# EAGLE schematic slave_board (EAGLE 9.2.2)

## Sheet 1 of 6: Main
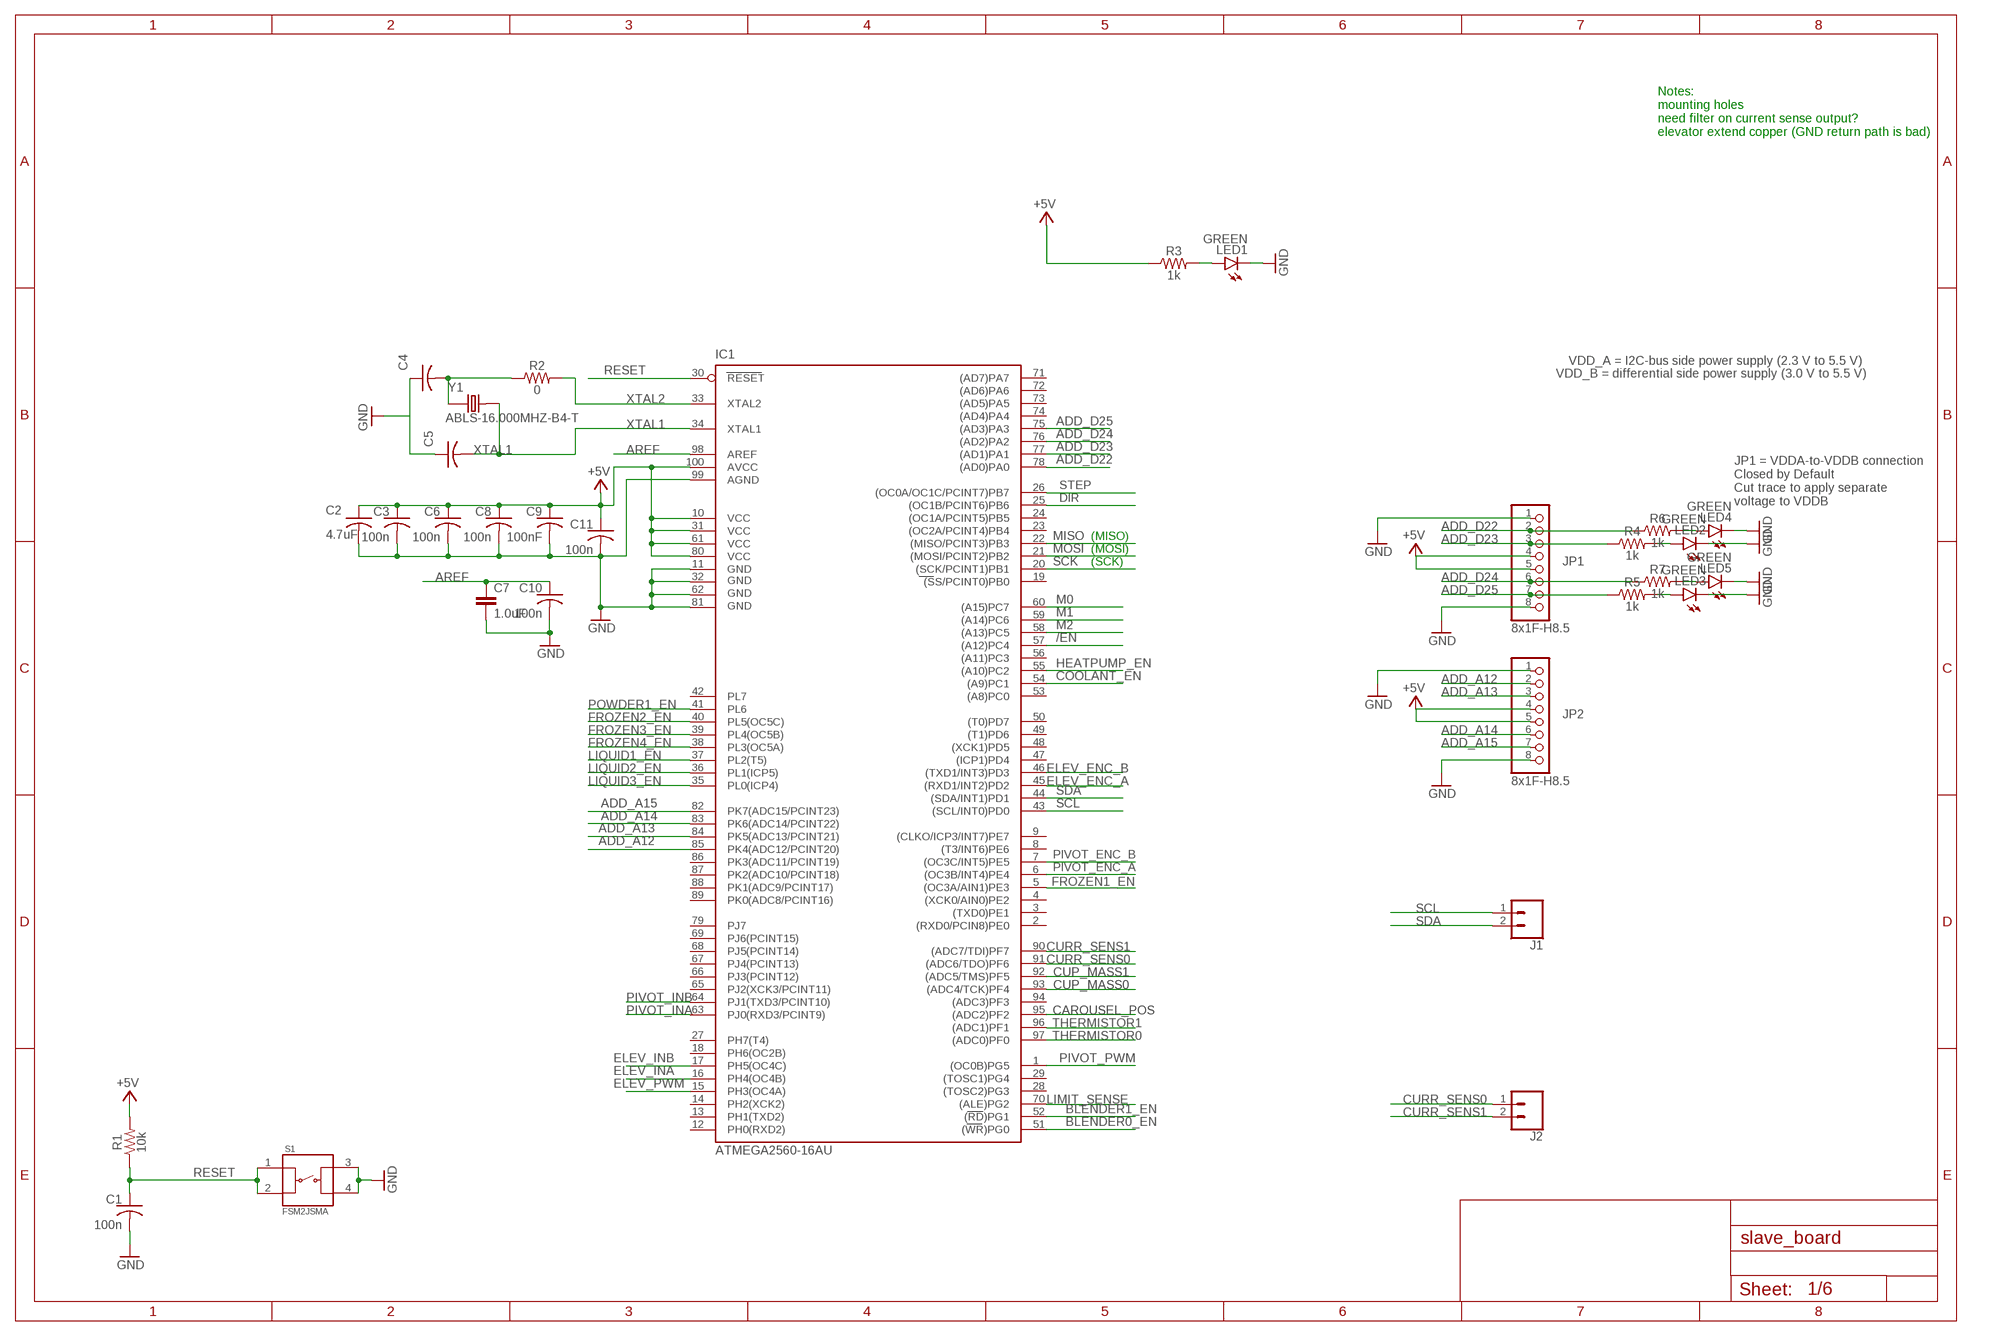
[diagram p0: schematic, sheet 1]

### Parts
C1  100n  C-USC0603  [C0603]
C2  4.7uF  C-USC0603  [C0603]
C3  100n  C-USC0603  [C0603]
C4  15pF  C-USC0603  [C0603]
C5  15pF  C-USC0603  [C0603]
C6  100n  C-USC0603  [C0603]
C7  1.0uF  1.0UF-0603-16V-10%  [0603]
C8  100n  C-USC0603  [C0603]
C9  100nF  C-USC0603  [C0603]
C10  100n  C-USC0603  [C0603]
C11  100n  C-USC0603  [C0603]
IC1  ATMEGA2560-16AU  ATMEGA25602560-16AU  [TQFP100]
J1  CONN_02  [1X02]
J2  CONN_02  [1X02]
JP1  8x1F-H8.5  PINHD-1X8  [1X08]
JP2  8x1F-H8.5  PINHD-1X8  [1X08]
LED1  GREEN  LEDCHIP-LED0805  [CHIP-LED0805]
LED2  GREEN  LEDCHIP-LED0805  [CHIP-LED0805]
LED3  GREEN  LEDCHIP-LED0805  [CHIP-LED0805]
LED4  GREEN  LEDCHIP-LED0805  [CHIP-LED0805]
LED5  GREEN  LEDCHIP-LED0805  [CHIP-LED0805]
R1  10k  10KOHM-0603-1/10W-1%  [0603]
R2  0  0OHM-0603-1/10W-5%  [0603]
R3  1k  1KOHM-0603-1/10W-1%  [0603]
R4  1k  1KOHM-0603-1/10W-1%  [0603]
R5  1k  1KOHM-0603-1/10W-1%  [0603]
R6  1k  1KOHM-0603-1/10W-1%  [0603]
R7  1k  1KOHM-0603-1/10W-1%  [0603]
S1  FSM2JSMA  [FSM2JSMA]
Y1  ABLS-16.000MHZ-B4-T  [ABLS-16.000MHZ-B4-T]

### Nets
+5V: C2.1 C3.1 C6.1 C8.1 C9.1 C11.1 IC1.10(VCC) IC1.31(VCC1) IC1.61(VCC2) IC1.80(VCC3) IC1.100(AVCC) JP1.4 JP1.5 JP2.4 JP2.5 R1.2 R3.1 ; also sheet 2,3,5,6
/EN: IC1.57((A12)PC4) ; also sheet 3
ADD_A12: IC1.85(PK4(ADC12/PCINT20)) JP2.2
ADD_A13: IC1.84(PK5(ADC13/PCINT21)) JP2.3
ADD_A14: IC1.83(PK6(ADC14/PCINT22)) JP2.6
ADD_A15: IC1.82(PK7(ADC15/PCINT23)) JP2.7
ADD_D22: IC1.78((AD0)PA0) JP1.2 R6.1
ADD_D23: IC1.77((AD1)PA1) JP1.3 R4.1
ADD_D24: IC1.76((AD2)PA2) JP1.6 R7.1
ADD_D25: IC1.75((AD3)PA3) JP1.7 R5.1
AREF: C7.1 C10.1 IC1.98(AREF)
BLENDER0_EN: IC1.51((WR)PG0) ; also sheet 3
BLENDER1_EN: IC1.52((RD)PG1) ; also sheet 3
CAROUSEL_POS: IC1.95((ADC2)PF2) ; also sheet 5
COOLANT_EN: IC1.54((A9)PC1) ; also sheet 3
CUP_MASS0: IC1.93((ADC4/TCK)PF4) ; also sheet 5
CUP_MASS1: IC1.92((ADC5/TMS)PF5) ; also sheet 5
CURR_SENS0: IC1.91((ADC6/TDO)PF6) J2.1 ; also sheet 4
CURR_SENS1: IC1.90((ADC7/TDI)PF7) J2.2 ; also sheet 4
DIR [gnd]: IC1.25((OC1B/PCINT6)PB6) ; also sheet 3
ELEV_ENC_A: IC1.45((RXD1/INT2)PD2) ; also sheet 5
ELEV_ENC_B: IC1.46((TXD1/INT3)PD3) ; also sheet 5
ELEV_INA: IC1.16(PH4(OC4B)) ; also sheet 4
ELEV_INB: IC1.17(PH5(OC4C)) ; also sheet 4
ELEV_PWM: IC1.15(PH3(OC4A)) ; also sheet 4
FROZEN1_EN: IC1.5((OC3A/AIN1)PE3) ; also sheet 3
FROZEN2_EN: IC1.40(PL5(OC5C)) ; also sheet 3
FROZEN3_EN: IC1.39(PL4(OC5B)) ; also sheet 3
FROZEN4_EN: IC1.38(PL3(OC5A)) ; also sheet 3
GND: C1.2 C2.2 C3.2 C4.1 C5.1 C6.2 C7.2 C8.2 C9.2 C10.2 C11.2 IC1.11(GND) IC1.32(GND1) IC1.62(GND2) IC1.81(GND3) IC1.99(AGND) JP1.1 JP1.8 JP2.1 JP2.8 LED1.C LED2.C LED3.C LED4.C LED5.C S1.3 S1.4 ; also sheet 2,3,4,5,6
HEATPUMP_EN: IC1.55((A10)PC2) ; also sheet 3
LIMIT_SENSE: IC1.70((ALE)PG2) ; also sheet 5
LIQUID1_EN: IC1.37(PL2(T5)) ; also sheet 3
LIQUID2_EN: IC1.36(PL1(ICP5)) ; also sheet 3
LIQUID3_EN: IC1.35(PL0(ICP4)) ; also sheet 3
M0: IC1.60((A15)PC7) ; also sheet 3
M1: IC1.59((A14)PC6) ; also sheet 3
M2: IC1.58((A13)PC5) ; also sheet 3
MISO: IC1.22((MISO/PCINT3)PB3) ; also sheet 2
MOSI: IC1.21((MOSI/PCINT2)PB2) ; also sheet 2
N$2: LED5.A R7.2
N$3: LED1.A R3.2
N$5: LED3.A R5.2
N$9: LED4.A R6.2
N$10: LED2.A R4.2
N$13: C4.2 R2.1 Y1.1
PIVOT_ENC_A: IC1.6((OC3B/INT4)PE4) ; also sheet 5
PIVOT_ENC_B: IC1.7((OC3C/INT5)PE5) ; also sheet 5
PIVOT_INA: IC1.63(PJ0(RXD3/PCINT9)) ; also sheet 4
PIVOT_INB: IC1.64(PJ1(TXD3/PCINT10)) ; also sheet 4
PIVOT_PWM: IC1.1((OC0B)PG5) ; also sheet 4
POWDER1_EN: IC1.41(PL6) ; also sheet 3
RESET: C1.1 IC1.30(RESET) R1.1 S1.1 S1.2 ; also sheet 2
SCK: IC1.20((SCK/PCINT1)PB1) ; also sheet 2
SCL: IC1.43((SCL/INT0)PD0) J1.1 ; also sheet 2
SDA: IC1.44((SDA/INT1)PD1) J1.2 ; also sheet 2
STEP: IC1.26((OC0A/OC1C/PCINT7)PB7) ; also sheet 3
THERMISTOR0 [gnd]: IC1.97((ADC0)PF0) ; also sheet 5
THERMISTOR1: IC1.96((ADC1)PF1) ; also sheet 5
XTAL1: C5.2 IC1.34(XTAL1) Y1.2
XTAL2: IC1.33(XTAL2) R2.2
Unconnected: IC1.2((RXD0/PCIN8)PE0) IC1.3((TXD0)PE1) IC1.4((XCK0/AIN0)PE2) IC1.8((T3/INT6)PE6) IC1.9((CLKO/ICP3/INT7)PE7) IC1.12(PH0(RXD2)) IC1.13(PH1(TXD2)) IC1.14(PH2(XCK2)) IC1.18(PH6(OC2B)) IC1.19((SS/PCINT0)PB0) IC1.23((OC2A/PCINT4)PB4) IC1.24((OC1A/PCINT5)PB5) IC1.27(PH7(T4)) IC1.28((TOSC2)PG3) IC1.29((TOSC1)PG4) IC1.42(PL7) IC1.47((ICP1)PD4) IC1.48((XCK1)PD5) IC1.49((T1)PD6) IC1.50((T0)PD7) IC1.53((A8)PC0) IC1.56((A11)PC3) IC1.65(PJ2(XCK3/PCINT11)) IC1.66(PJ3(PCINT12)) IC1.67(PJ4(PCINT13)) IC1.68(PJ5(PCINT14)) IC1.69(PJ6(PCINT15)) IC1.71((AD7)PA7) IC1.72((AD6)PA6) IC1.73((AD5)PA5) IC1.74((AD4)PA4) IC1.79(PJ7) IC1.86(PK3(ADC11/PCINT19)) IC1.87(PK2(ADC10/PCINT18)) IC1.88(PK1(ADC9/PCINT17)) IC1.89(PK0(ADC8/PCINT16)) IC1.94((ADC3)PF3)

### Notes on the sheet
- Notes:
  mounting holes
  need filter on current sense output?
  elevator extend copper (GND return path is bad)
- VDD_A = I2C-bus side power supply (2.3 V to 5.5 V)
- VDD_B = differential side power supply (3.0 V to 5.5 V)
- JP1 = VDDA-to-VDDB connection
  Closed by Default
  Cut trace to apply separate 
  voltage to VDDB
- (MISO)
- (MOSI)
- (SCK)

## Sheet 2 of 6: COMMS
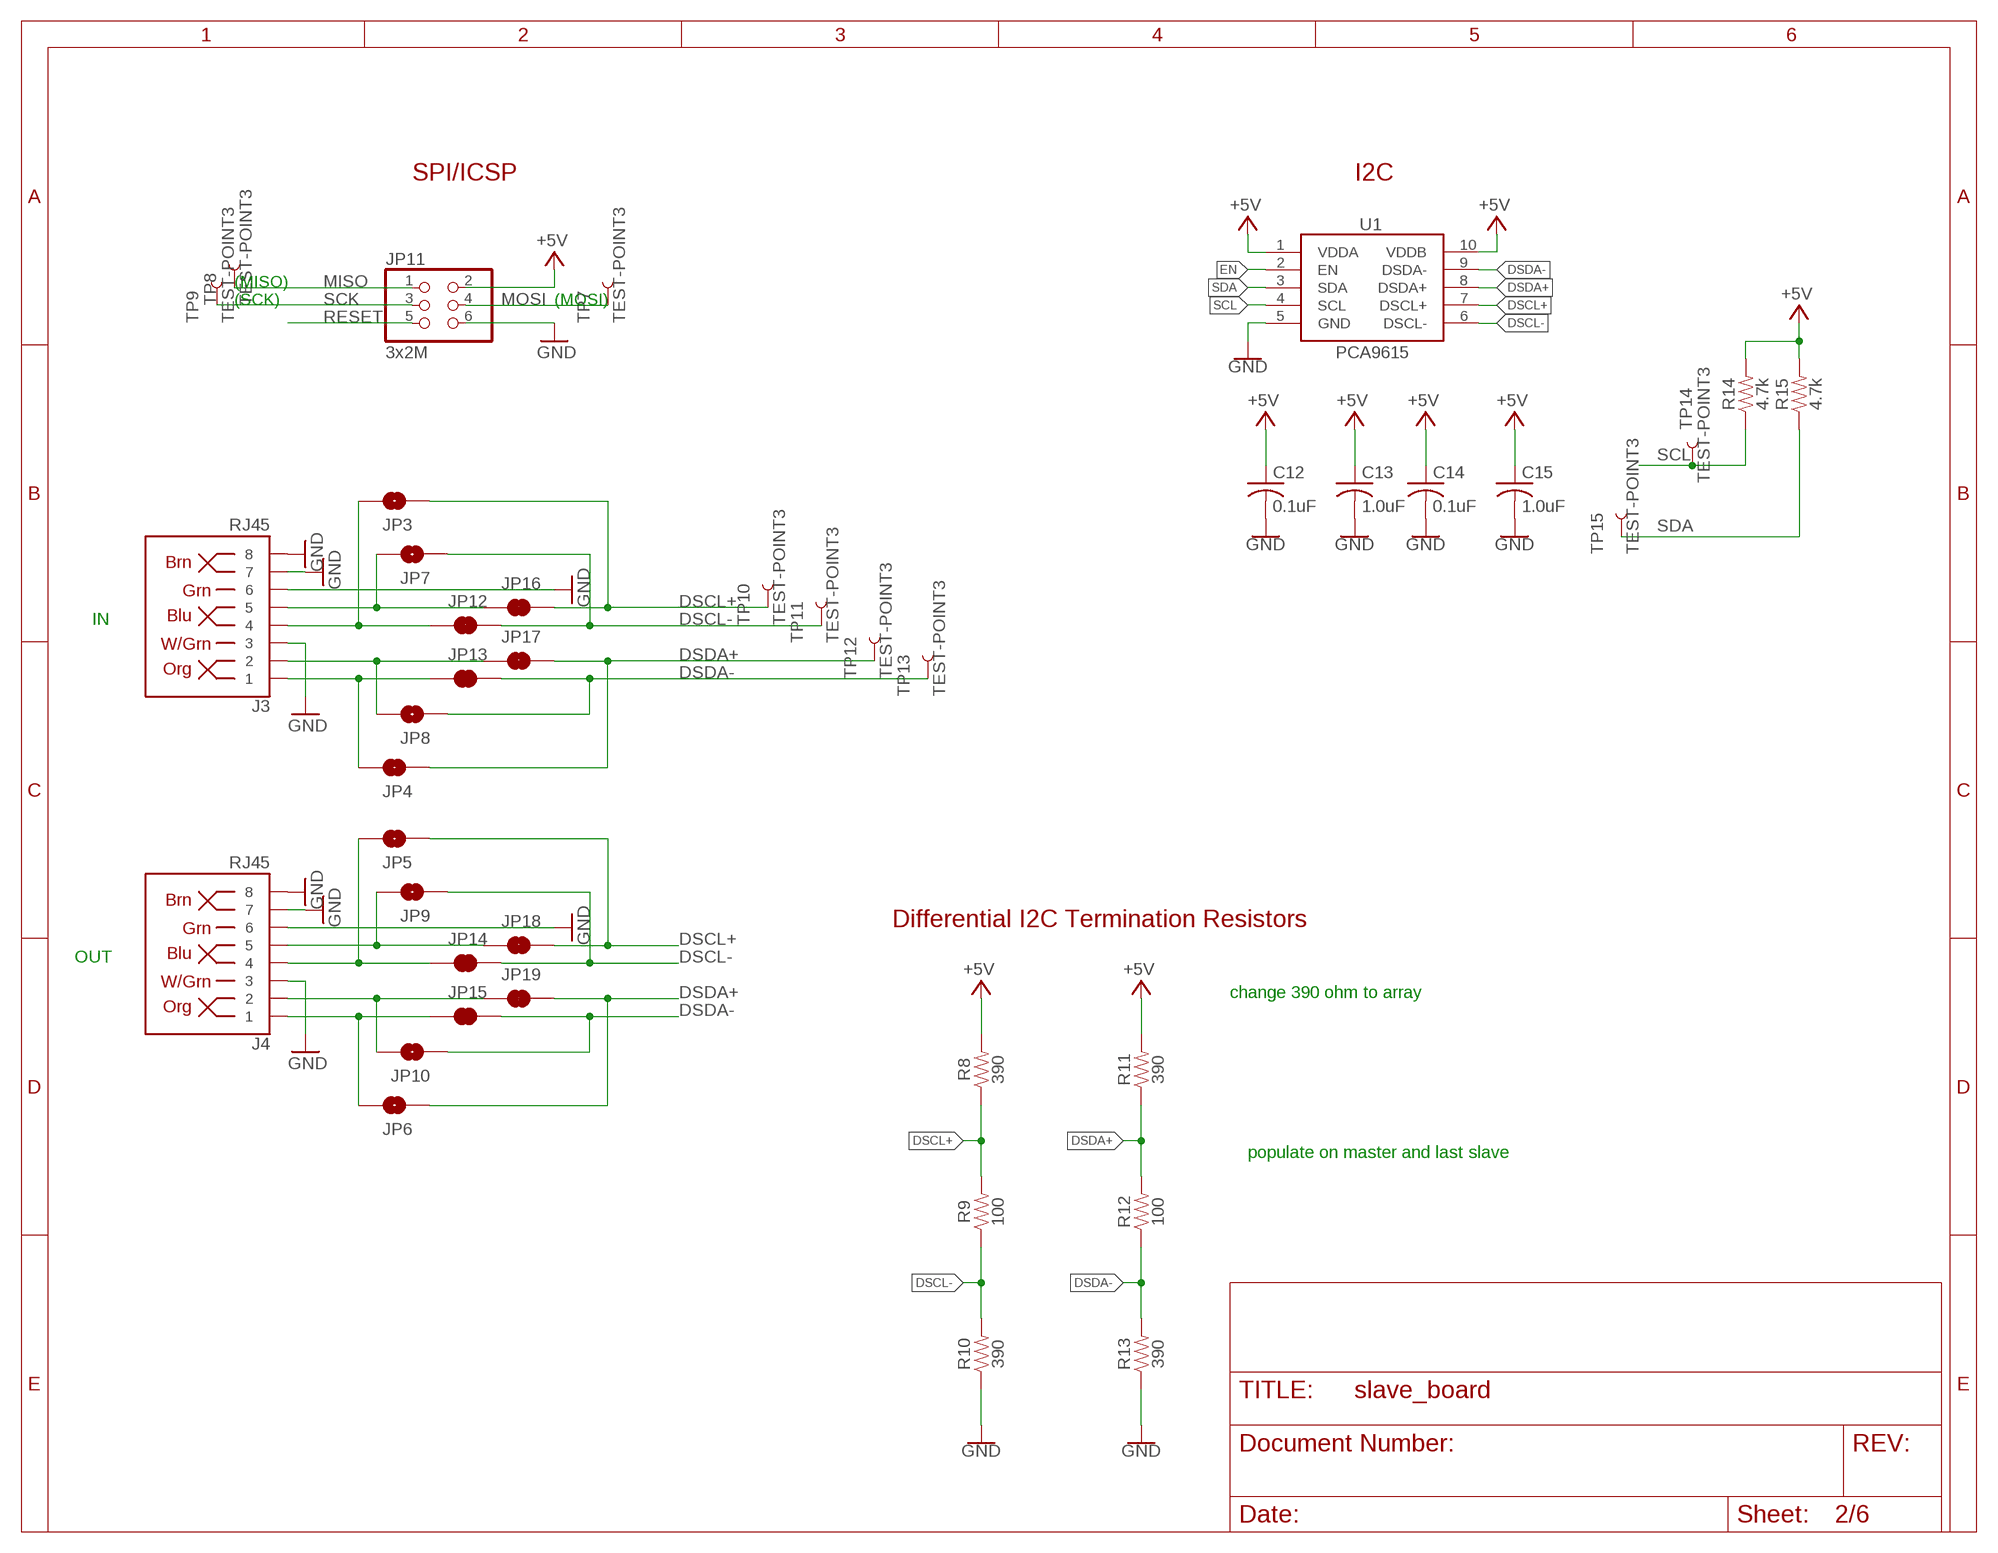
[diagram p1: schematic, sheet 2]

### Parts
C12  0.1uF  C-USC0603  [C0603]
C13  1.0uF  C-USC0603  [C0603]
C14  0.1uF  C-USC0603  [C0603]
C15  1.0uF  C-USC0603  [C0603]
J3  RJ45  RJ45-8  [RJ45-8]
J4  RJ45  RJ45-8  [RJ45-8]
JP3  JUMPER-SMT_2_NO_NO-SILK  [SMT-JUMPER_2_NO_NO-SILK]
JP4  JUMPER-SMT_2_NO_NO-SILK  [SMT-JUMPER_2_NO_NO-SILK]
JP5  JUMPER-SMT_2_NO_NO-SILK  [SMT-JUMPER_2_NO_NO-SILK]
JP6  JUMPER-SMT_2_NO_NO-SILK  [SMT-JUMPER_2_NO_NO-SILK]
JP7  JUMPER-SMT_2_NO_NO-SILK  [SMT-JUMPER_2_NO_NO-SILK]
JP8  JUMPER-SMT_2_NO_NO-SILK  [SMT-JUMPER_2_NO_NO-SILK]
JP9  JUMPER-SMT_2_NO_NO-SILK  [SMT-JUMPER_2_NO_NO-SILK]
JP10  JUMPER-SMT_2_NO_NO-SILK  [SMT-JUMPER_2_NO_NO-SILK]
JP11  3x2M  PINHD-2X3  [2X03]
JP12  JUMPER-SMT_2_NC_TRACE_NO-SILK  [SMT-JUMPER_2_NC_TRACE_NO-SILK]
JP13  JUMPER-SMT_2_NC_TRACE_NO-SILK  [SMT-JUMPER_2_NC_TRACE_NO-SILK]
JP14  JUMPER-SMT_2_NC_TRACE_NO-SILK  [SMT-JUMPER_2_NC_TRACE_NO-SILK]
JP15  JUMPER-SMT_2_NC_TRACE_NO-SILK  [SMT-JUMPER_2_NC_TRACE_NO-SILK]
JP16  JUMPER-SMT_2_NC_TRACE_NO-SILK  [SMT-JUMPER_2_NC_TRACE_NO-SILK]
JP17  JUMPER-SMT_2_NC_TRACE_NO-SILK  [SMT-JUMPER_2_NC_TRACE_NO-SILK]
JP18  JUMPER-SMT_2_NC_TRACE_NO-SILK  [SMT-JUMPER_2_NC_TRACE_NO-SILK]
JP19  JUMPER-SMT_2_NC_TRACE_NO-SILK  [SMT-JUMPER_2_NC_TRACE_NO-SILK]
R8  390  390OHM-0603-1/10W-1%  [0603]
R9  100  100OHM-0603-1/10W-1%  [0603]
R10  390  390OHM-0603-1/10W-1%  [0603]
R11  390  390OHM-0603-1/10W-1%  [0603]
R12  100  100OHM-0603-1/10W-1%  [0603]
R13  390  390OHM-0603-1/10W-1%  [0603]
R14  4.7k  4.7KOHM-0603-1/10W-1%  [0603]
R15  4.7k  4.7KOHM-0603-1/10W-1%  [0603]
TP7  TEST-POINT3  [PAD.03X.03]
TP8  TEST-POINT3  [PAD.03X.03]
TP9  TEST-POINT3  [PAD.03X.03]
TP10  TEST-POINT3  [PAD.03X.03]
TP11  TEST-POINT3  [PAD.03X.03]
TP12  TEST-POINT3  [PAD.03X.03]
TP13  TEST-POINT3  [PAD.03X.03]
TP14  TEST-POINT3  [PAD.03X.03]
TP15  TEST-POINT3  [PAD.03X.03]
U1  PCA9615  [SPARKFUN-IC-COMMS_TSSOP10]

### Nets
+5V: C12.1 C13.1 C14.1 C15.1 JP11.2 R8.2 R11.2 R14.2 R15.2 U1.1(VDDA) U1.10(VDDB) ; also sheet 1,3,5,6
DSCL+: J3.5 J4.5 JP3.1 JP5.1 JP7.2 JP9.2 JP16.1 JP16.2 JP18.1 JP18.2 R8.1 R9.2 TP10.P$1 U1.7(DSCL+)
DSCL-: J3.4 J4.4 JP3.2 JP5.2 JP7.1 JP9.1 JP12.1 JP12.2 JP14.1 JP14.2 R9.1 R10.2 TP11.P$1 U1.6(DSCL-)
DSDA+: J3.2 J4.2 JP4.1 JP6.1 JP8.2 JP10.2 JP17.1 JP17.2 JP19.1 JP19.2 R11.1 R12.2 TP12.P$1 U1.8(DSDA+)
DSDA-: J3.1 J4.1 JP4.2 JP6.2 JP8.1 JP10.1 JP13.1 JP13.2 JP15.1 JP15.2 R12.1 R13.2 TP13.P$1 U1.9(DSDA-)
EN: U1.2(EN)
GND: C12.2 C13.2 C14.2 C15.2 J3.3 J3.6 J3.7 J3.8 J4.3 J4.6 J4.7 J4.8 JP11.6 R10.1 R13.1 U1.5(GND) ; also sheet 1,3,4,5,6
MISO: JP11.1 TP8.P$1 ; also sheet 1
MOSI: JP11.4 TP7.P$1 ; also sheet 1
RESET: JP11.5 ; also sheet 1
SCK: JP11.3 TP9.P$1 ; also sheet 1
SCL: R14.1 TP14.P$1 U1.4(SCL) ; also sheet 1
SDA: R15.1 TP15.P$1 U1.3(SDA) ; also sheet 1

### Notes on the sheet
- SPI/ICSP | I2C
- (MISO)
- (SCK) | (MOSI)
- IN
- Differential I2C Termination Resistors
- OUT
- change 390 ohm to array
- populate on master and last slave

## Sheet 3 of 6: Motors1
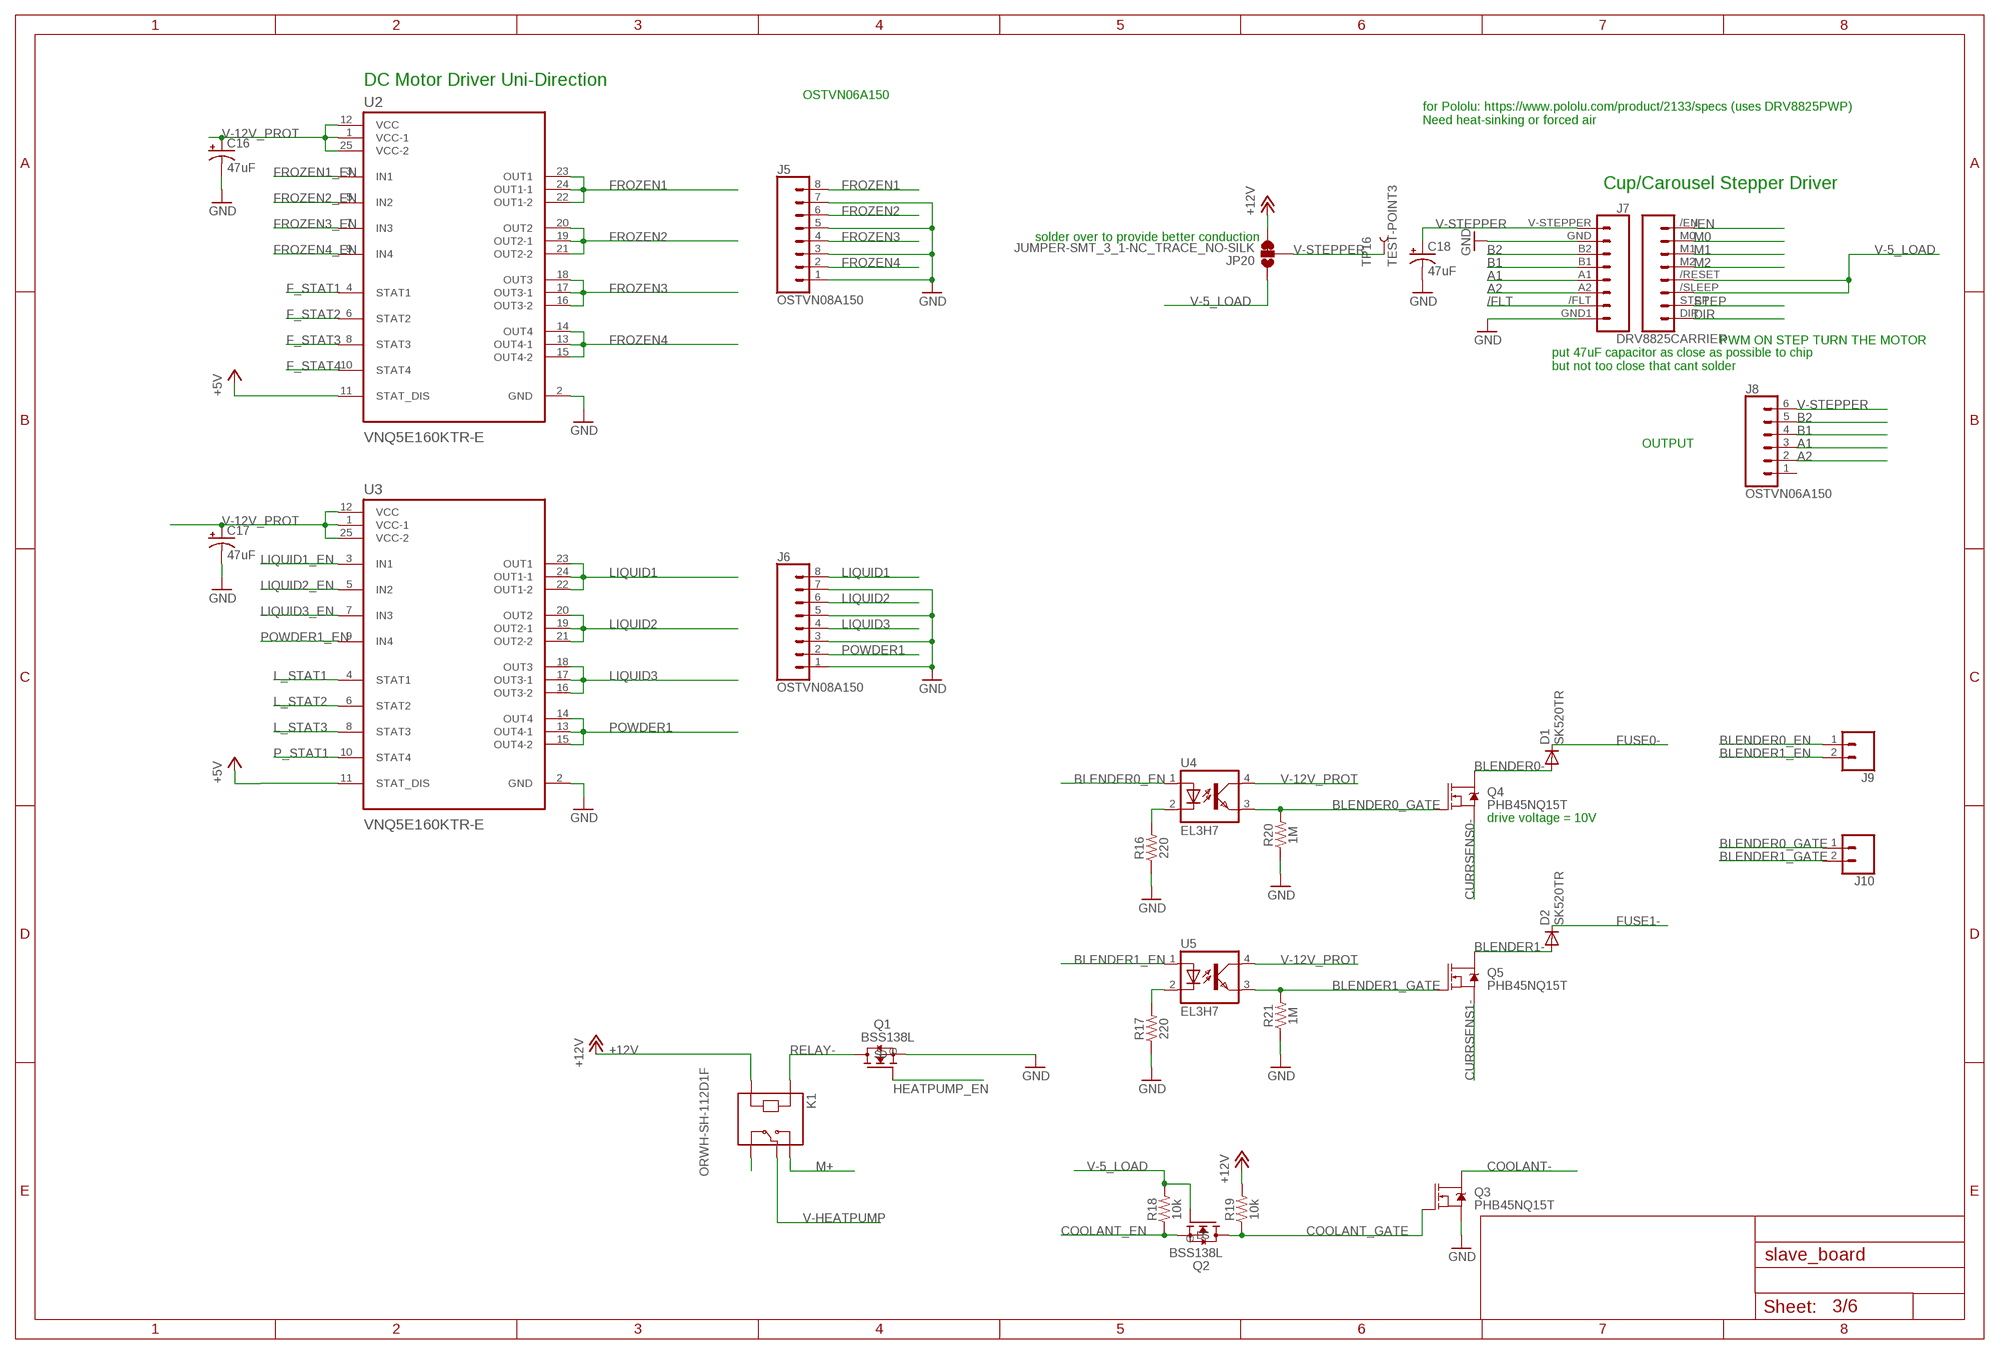
[diagram p2: schematic, sheet 3]

### Parts
C16  47uF  47UF-POLAR-PANASONIC_D-35V-20%  [PANASONIC_D]
C17  47uF  47UF-POLAR-PANASONIC_D-35V-20%  [PANASONIC_D]
C18  47uF  47UF-POLAR-PANASONIC_D-35V-20%  [PANASONIC_D]
D1  SK520TR  [SK520TR]
D2  SK520TR  [SK520TR]
J5  OSTVN08A150  [8PIN_SCREW_TERMINAL]
J6  OSTVN08A150  [8PIN_SCREW_TERMINAL]
J7  DRV8825CARRIER  [DRV8825CARRIER]
J8  OSTVN06A150  [6PIN_SCREW_TERMINAL]
J9  CONN_02  [1X02]
J10  CONN_02  [1X02]
JP20  JUMPER-SMT_3_1-NC_TRACE_NO-SILK  [SMT-JUMPER_3_1-NC_TRACE_NO-SILK]
K1  ORWH-SH-112D1F  [ORWH-SH-112D1F]
Q1  BSS138L  [BSS138L]
Q2  BSS138L  [BSS138L]
Q3  PHB45NQ15T  [PHB45NQ15T]
Q4  PHB45NQ15T  [PHB45NQ15T]
Q5  PHB45NQ15T  [PHB45NQ15T]
R16  220  220OHM-0603-1/10W-1%  [0603]
R17  220  220OHM-0603-1/10W-1%  [0603]
R18  10k  10KOHM-0603-1/10W-1%  [0603]
R19  10k  10KOHM-0603-1/10W-1%  [0603]
R20  1M  1MOHM-0603-1/4W-5%  [0603]
R21  1M  1MOHM-0603-1/4W-5%  [0603]
TP16  TEST-POINT3  [PAD.03X.03]
U2  VNQ5E160KTR-E  [SOP80P1030X245-25N]
U3  VNQ5E160KTR-E  [SOP80P1030X245-25N]
U4  EL3H7  [EL3H7]
U5  EL3H7  [EL3H7]

### Nets
+5V: U2.11(STAT_DIS) U3.11(STAT_DIS) ; also sheet 1,2,5,6
+12V [power]: JP20.3 K1.A2 R19.2 ; also sheet 4,6
/EN: J7./EN ; also sheet 1
/FLT: J7./FLT
A1: J7.A1 J8.3
A2: J7.A2 J8.2
B1: J7.B1 J8.4
B2: J7.B2 J8.5
BLENDER0-: D1.1(A) Q4.2(D) ; also sheet 4
BLENDER0_EN: J9.1 U4.1 ; also sheet 1
BLENDER0_GATE: J10.1 Q4.1(G) R20.2 U4.3
BLENDER1-: D2.1(A) Q5.2(D) ; also sheet 4
BLENDER1_EN: J9.2 U5.1 ; also sheet 1
BLENDER1_GATE: J10.2 Q5.1(G) R21.2 U5.3
COOLANT- [power]: Q3.2(D) ; also sheet 4
COOLANT_EN: Q2.S R18.1 ; also sheet 1
COOLANT_GATE: Q2.D Q3.1(G) R19.1
CURRSENS0-: Q4.3(S) ; also sheet 4
CURRSENS1-: Q5.3(S) ; also sheet 4
DIR [gnd]: J7.DIR ; also sheet 1
F_STAT1: U2.4(STAT1)
F_STAT2: U2.6(STAT2)
F_STAT3: U2.8(STAT3)
F_STAT4: U2.10(STAT4)
FROZEN1: J5.8 U2.22(OUT1-2) U2.23(OUT1) U2.24(OUT1-1)
FROZEN1_EN: U2.3(IN1) ; also sheet 1
FROZEN2: J5.6 U2.19(OUT2-1) U2.20(OUT2) U2.21(OUT2-2)
FROZEN2_EN: U2.5(IN2) ; also sheet 1
FROZEN3: J5.4 U2.16(OUT3-2) U2.17(OUT3-1) U2.18(OUT3)
FROZEN3_EN: U2.7(IN3) ; also sheet 1
FROZEN4: J5.2 U2.13(OUT4-1) U2.14(OUT4) U2.15(OUT4-2)
FROZEN4_EN: U2.9(IN4) ; also sheet 1
FUSE0- [HVDC]: D1.2(C) ; also sheet 4
FUSE1- [HVDC]: D2.2(C) ; also sheet 4
GND: C16.- C17.- C18.- J5.1 J5.3 J5.5 J5.7 J6.1 J6.3 J6.5 J6.7 J7.GND J7.GND1 Q1.S Q3.3(S) R16.1 R17.1 R20.1 R21.1 U2.2(GND) U3.2(GND) ; also sheet 1,2,4,5,6
HEATPUMP_EN: Q1.G ; also sheet 1
L_STAT1: U3.4(STAT1)
L_STAT2: U3.6(STAT2)
L_STAT3: U3.8(STAT3)
LIQUID1: J6.8 U3.22(OUT1-2) U3.23(OUT1) U3.24(OUT1-1)
LIQUID1_EN: U3.3(IN1) ; also sheet 1
LIQUID2: J6.6 U3.19(OUT2-1) U3.20(OUT2) U3.21(OUT2-2)
LIQUID2_EN: U3.5(IN2) ; also sheet 1
LIQUID3: J6.4 U3.16(OUT3-2) U3.17(OUT3-1) U3.18(OUT3)
LIQUID3_EN: U3.7(IN3) ; also sheet 1
M0: J7.M0 ; also sheet 1
M1: J7.M1 ; also sheet 1
M2: J7.M2 ; also sheet 1
M+ [mains]: K1.NO ; also sheet 6
N$6 [gnd]: K1.NC
N$7: R17.2 U5.2
N$14: R16.2 U4.2
P_STAT1: U3.10(STAT4)
POWDER1: J6.2 U3.13(OUT4-1) U3.14(OUT4) U3.15(OUT4-2)
POWDER1_EN: U3.9(IN4) ; also sheet 1
RELAY- [gnd]: K1.A1 Q1.D
STEP: J7.STEP ; also sheet 1
V-5_LOAD: J7./RESET J7./SLEEP JP20.1 Q2.G R18.2 ; also sheet 4,6
V-12V_PROT [power]: C16.+ C17.+ U2.1(VCC-1) U2.12(VCC) U2.25(VCC-2) U3.1(VCC-1) U3.12(VCC) U3.25(VCC-2) U4.4 U5.4 ; also sheet 4,6
V-HEATPUMP [mains]: K1.COM ; also sheet 4
V-STEPPER: C18.+ J7.V-STEPPER J8.6 JP20.2 TP16.P$1
Unconnected: J8.1

### Notes on the sheet
- DC Motor Driver Uni-Direction
- OSTVN06A150
- for Pololu: https://www.pololu.com/product/2133/specs (uses DRV8825PWP)
  Need heat-sinking or forced air
- Cup/Carousel Stepper Driver
- solder over to provide better conduction
- PWM ON STEP TURN THE MOTOR
- put 47uF capacitor as close as possible to chip
  but not too close that cant solder
- OUTPUT
- drive voltage = 10V

## Sheet 4 of 6: Motors2
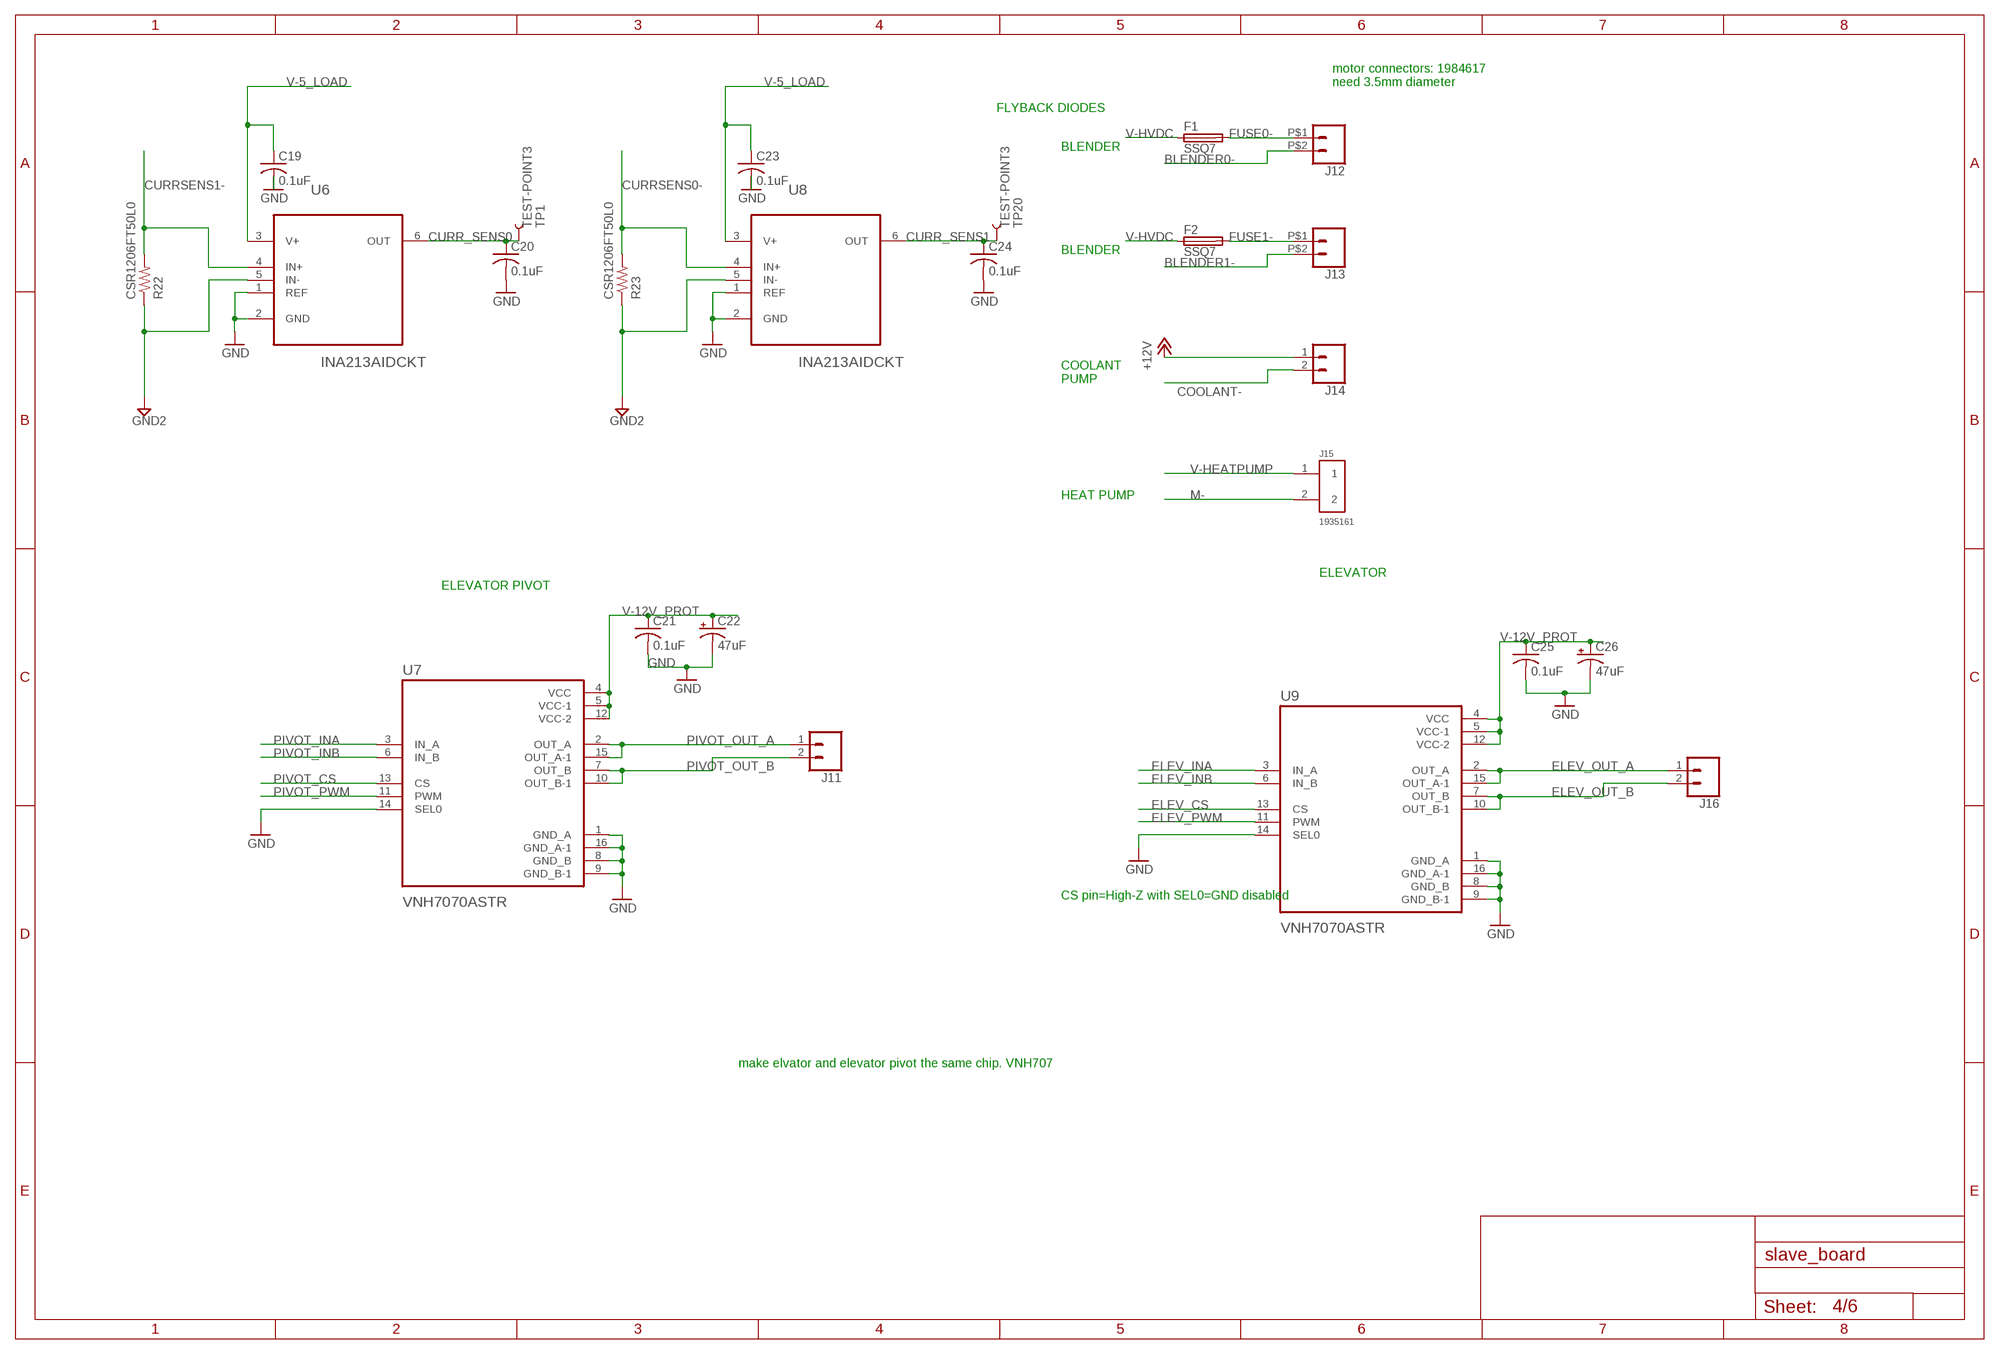
[diagram p3: schematic, sheet 4]

### Parts
C19  0.1uF  C-USC0603  [C0603]
C20  0.1uF  C-USC0603  [C0603]
C21  0.1uF  C-USC0603  [C0603]
C22  47uF  47UF-POLAR-PANASONIC_D-35V-20%  [PANASONIC_D]
C23  0.1uF  C-USC0603  [C0603]
C24  0.1uF  C-USC0603  [C0603]
C25  0.1uF  C-USC0603  [C0603]
C26  47uF  47UF-POLAR-PANASONIC_D-35V-20%  [PANASONIC_D]
F1  SSQ7  [SSQ7]
F2  SSQ7  [SSQ7]
J11  CONN_02  [1X02]
J12  CONN_02PTH2  [1X02_BIG]
J13  CONN_02PTH2  [1X02_BIG]
J14  CONN_02  [1X02]
J15  1935161  [PHOENIX_1935161]
J16  CONN_02  [1X02]
R22  CSR1206FT50L0  [CSR1206FT50L0]
R23  CSR1206FT50L0  [CSR1206FT50L0]
TP1  TEST-POINT3  [PAD.03X.03]
TP20  TEST-POINT3  [PAD.03X.03]
U6  INA213AIDCKT  [SOT65P210X110-6N]
U7  VNH7070ASTR  [VNH7070ASTR]
U8  INA213AIDCKT  [SOT65P210X110-6N]
U9  VNH7070ASTR  [VNH7070ASTR]

### Nets
+12V [power]: J14.1 ; also sheet 3,6
BLENDER0-: J12.P$2 ; also sheet 3
BLENDER1-: J13.P$2 ; also sheet 3
COOLANT- [power]: J14.2 ; also sheet 3
CURR_SENS0: C20.1 TP1.P$1 U6.6(OUT) ; also sheet 1
CURR_SENS1: C24.1 TP20.P$1 U8.6(OUT) ; also sheet 1
CURRSENS0-: R23.2 U8.4(IN+) ; also sheet 3
CURRSENS1-: R22.2 U6.4(IN+) ; also sheet 3
ELEV_CS: U9.13(CS)
ELEV_INA: U9.3(IN_A) ; also sheet 1
ELEV_INB: U9.6(IN_B) ; also sheet 1
ELEV_OUT_A [power]: J16.1 U9.2(OUT_A) U9.15(OUT_A-1)
ELEV_OUT_B [power]: J16.2 U9.7(OUT_B) U9.10(OUT_B-1)
ELEV_PWM: U9.11(PWM) ; also sheet 1
FUSE0- [HVDC]: F1.2 J12.P$1 ; also sheet 3
FUSE1- [HVDC]: F2.2 J13.P$1 ; also sheet 3
GND: C19.2 C20.2 C21.2 C22.- C23.2 C24.2 C25.2 C26.- U6.1(REF) U6.2(GND) U7.1(GND_A) U7.8(GND_B) U7.9(GND_B-1) U7.14(SEL0) U7.16(GND_A-1) U8.1(REF) U8.2(GND) U9.1(GND_A) U9.8(GND_B) U9.9(GND_B-1) U9.14(SEL0) U9.16(GND_A-1) ; also sheet 1,2,3,5,6
GND2: R22.1 R23.1 U6.5(IN-) U8.5(IN-) ; also sheet 6
M- [mains]: J15.2 ; also sheet 6
PIVOT_CS: U7.13(CS)
PIVOT_INA: U7.3(IN_A) ; also sheet 1
PIVOT_INB: U7.6(IN_B) ; also sheet 1
PIVOT_OUT_A [power]: J11.1 U7.2(OUT_A) U7.15(OUT_A-1)
PIVOT_OUT_B [power]: J11.2 U7.7(OUT_B) U7.10(OUT_B-1)
PIVOT_PWM: U7.11(PWM) ; also sheet 1
V-5_LOAD: C19.1 C23.1 U6.3(V+) U8.3(V+) ; also sheet 3,6
V-12V_PROT [power]: C21.1 C22.+ C25.1 C26.+ U7.4(VCC) U7.5(VCC-1) U7.12(VCC-2) U9.4(VCC) U9.5(VCC-1) U9.12(VCC-2) ; also sheet 3,6
V-HEATPUMP [mains]: J15.1 ; also sheet 3
V-HVDC [HVDC]: F1.1 F2.1 ; also sheet 6

### Notes on the sheet
- motor connectors: 1984617
  need 3.5mm diameter
- FLYBACK DIODES
- BLENDER
- BLENDER
- COOLANT
  PUMP
- HEAT PUMP
- ELEVATOR
- ELEVATOR PIVOT
- CS pin=High-Z with SEL0=GND disabled
- make elvator and elevator pivot the same chip. VNH707

## Sheet 5 of 6: Sensors
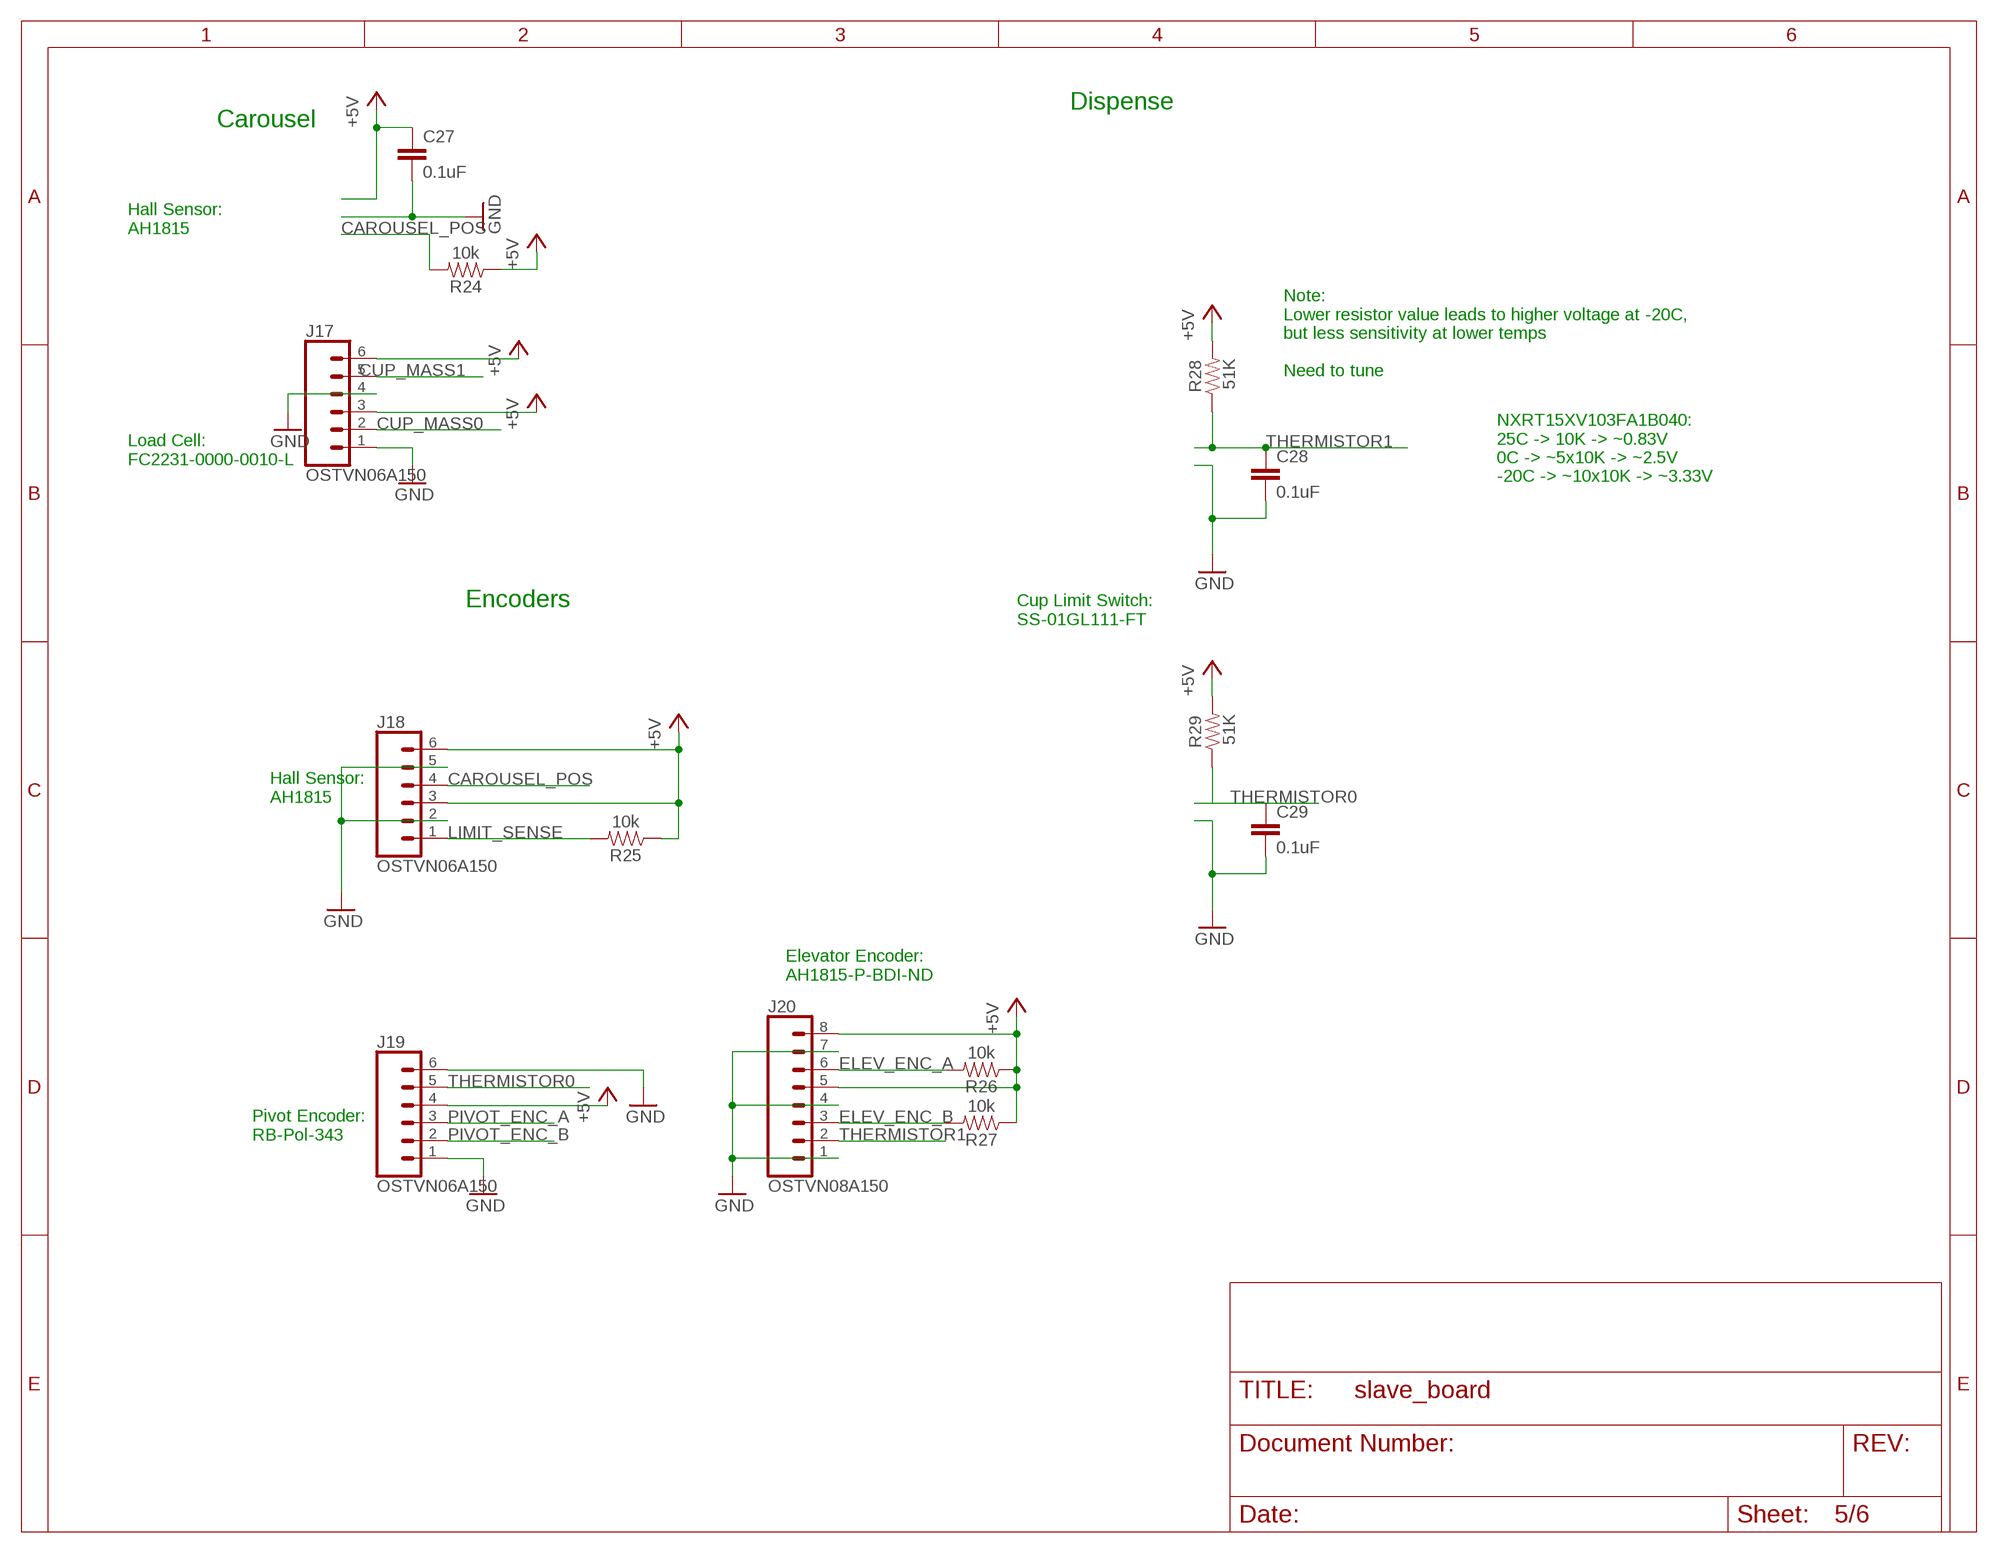
[diagram p4: schematic, sheet 5]

### Parts
C27  0.1uF  0.1UF-0603-25V-(+80/-20%)  [0603]
C28  0.1uF  0.1UF-0603-25V-(+80/-20%)  [0603]
C29  0.1uF  0.1UF-0603-25V-(+80/-20%)  [0603]
J17  OSTVN06A150  [6PIN_SCREW_TERMINAL]
J18  OSTVN06A150  [6PIN_SCREW_TERMINAL]
J19  OSTVN06A150  [6PIN_SCREW_TERMINAL]
J20  OSTVN08A150  [8PIN_SCREW_TERMINAL]
R24  10k  10KOHM-0603-1/10W-1%  [0603]
R25  10k  10KOHM-0603-1/10W-1%  [0603]
R26  10k  10KOHM-0603-1/10W-1%  [0603]
R27  10k  10KOHM-0603-1/10W-1%  [0603]
R28  51K  RESISTOR0603  [0603]
R29  51K  RESISTOR0603  [0603]

### Nets
+5V: C27.1 J17.3 J17.6 J18.3 J18.6 J19.4 J20.5 J20.8 R24.1 R25.1 R26.1 R27.1 R28.2 R29.2 ; also sheet 1,2,3,6
CAROUSEL_POS: J18.4 R24.2 ; also sheet 1
CUP_MASS0: J17.2 ; also sheet 1
CUP_MASS1: J17.5 ; also sheet 1
ELEV_ENC_A: J20.6 R26.2 ; also sheet 1
ELEV_ENC_B: J20.3 R27.2 ; also sheet 1
GND: C27.2 C28.2 C29.2 J17.1 J17.4 J18.2 J18.5 J19.1 J19.6 J20.1 J20.4 J20.7 ; also sheet 1,2,3,4,6
LIMIT_SENSE: J18.1 R25.2 ; also sheet 1
PIVOT_ENC_A: J19.3 ; also sheet 1
PIVOT_ENC_B: J19.2 ; also sheet 1
THERMISTOR0 [gnd]: C29.1 J19.5 R29.1 ; also sheet 1
THERMISTOR1: C28.1 J20.2 R28.1 ; also sheet 1

### Notes on the sheet
- Dispense
- Carousel
- Hall Sensor:
  AH1815
- Note:
  Lower resistor value leads to higher voltage at -20C, 
  but less sensitivity at lower temps
  
  Need to tune
- Load Cell:
  FC2231-0000-0010-L
- NXRT15XV103FA1B040:
  25C -> 10K -> ~0.83V
  0C -> ~5x10K -> ~2.5V
  -20C -> ~10x10K -> ~3.33V
- Encoders
- Cup Limit Switch:
  SS-01GL111-FT
- Hall Sensor:
  AH1815
- Elevator Encoder:
  AH1815-P-BDI-ND
- Pivot Encoder:
  RB-Pol-343

## Sheet 6 of 6: Power
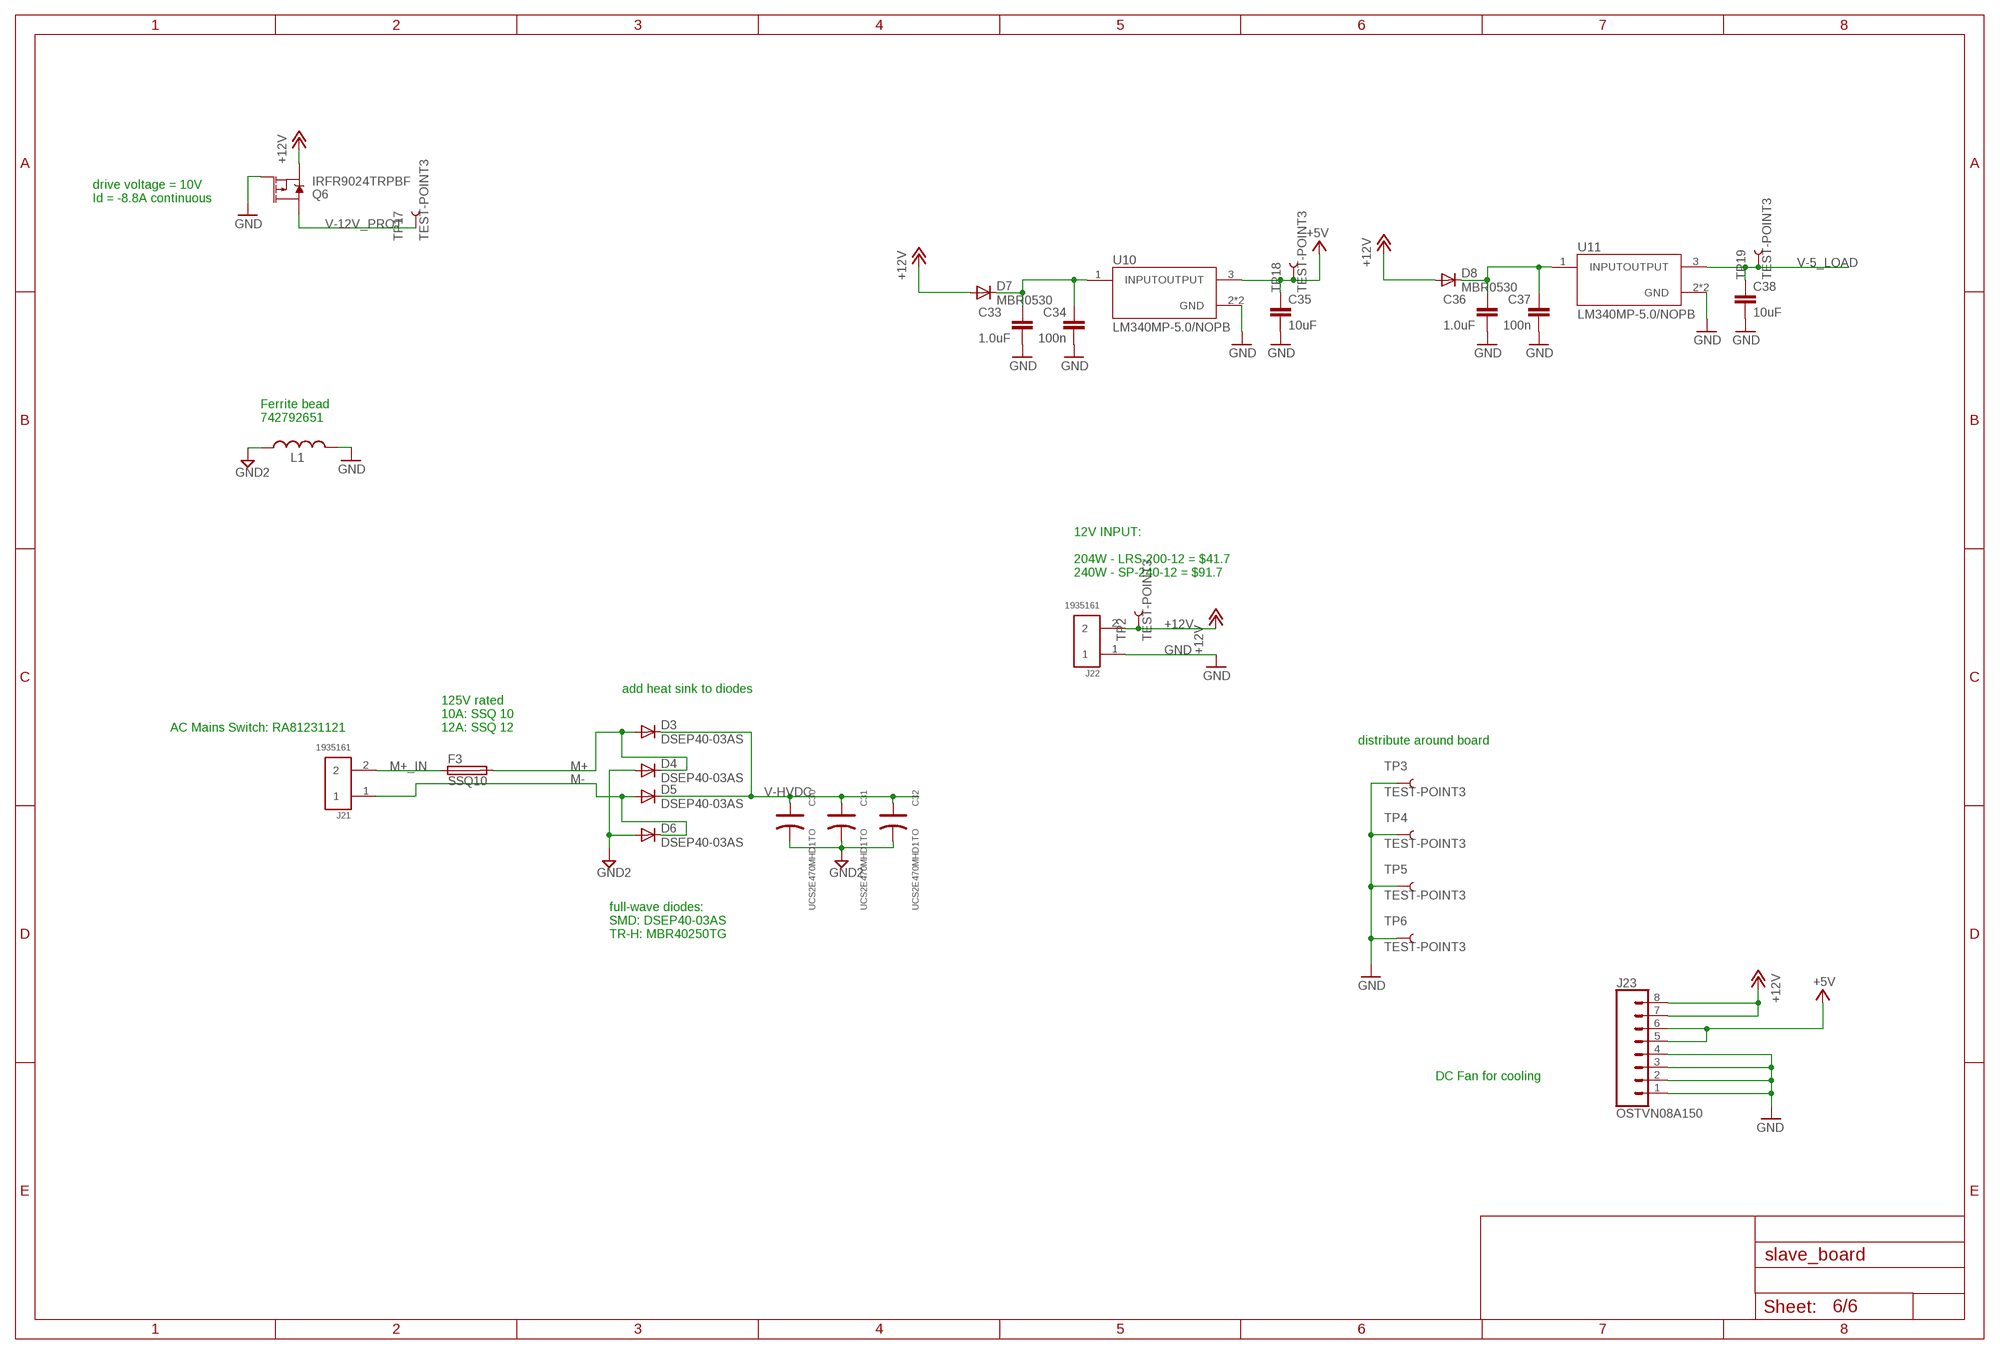
[diagram p5: schematic, sheet 6]

### Parts
C30  UCS2E470MHD1TO  [UCS2E470MHD1TO]
C31  UCS2E470MHD1TO  [UCS2E470MHD1TO]
C32  UCS2E470MHD1TO  [UCS2E470MHD1TO]
C33  1.0uF  1.0UF-0603-16V-10%  [0603]
C34  100n  C-EU0603-RND  [C0603-ROUND]
C35  10uF  10UF-0805-10V-10%  [0805]
C36  1.0uF  1.0UF-0603-16V-10%  [0603]
C37  100n  C-EU0603-RND  [C0603-ROUND]
C38  10uF  10UF-0805-10V-10%  [0805]
D3  DSEP40-03AS  [DSEP40-03AS]
D4  DSEP40-03AS  [DSEP40-03AS]
D5  DSEP40-03AS  [DSEP40-03AS]
D6  DSEP40-03AS  [DSEP40-03AS]
D7  MBR0530  [MBR0530]
D8  MBR0530  [MBR0530]
F3  SSQ10  [SSQ10]
J21  1935161  [PHOENIX_1935161]
J22  1935161  [PHOENIX_1935161]
J23  OSTVN08A150  [8PIN_SCREW_TERMINAL]
L1  742792651  [742792651]
Q6  IRFR9024TRPBF  [IRFR9024TRPBF]
TP2  TEST-POINT3  [PAD.03X.03]
TP3  TEST-POINT3  [PAD.03X.03]
TP4  TEST-POINT3  [PAD.03X.03]
TP5  TEST-POINT3  [PAD.03X.03]
TP6  TEST-POINT3  [PAD.03X.03]
TP17  TEST-POINT3  [PAD.03X.03]
TP18  TEST-POINT3  [PAD.03X.03]
TP19  TEST-POINT3  [PAD.03X.03]
U10  LM340MP-5.0/NOPB  [SOT230P700X180-4N]
U11  LM340MP-5.0/NOPB  [SOT230P700X180-4N]

### Nets
+5V: C35.1 J23.5 J23.6 TP18.P$1 U10.3(OUTPUT) ; also sheet 1,2,3,5
+12V [power]: D7.1(A) D8.1(A) J22.2 J23.7 J23.8 Q6.S TP2.P$1 ; also sheet 3,4
GND: C33.2 C34.2 C35.2 C36.2 C37.2 C38.2 J22.1 J23.1 J23.2 J23.3 J23.4 L1.P$2 Q6.G TP3.P$1 TP4.P$1 TP5.P$1 TP6.P$1 U10.2(GND) U10.4(GND) U11.2(GND) U11.4(GND) ; also sheet 1,2,3,4,5
GND2: C30.- C31.- C32.- D4.1(A) D4.3(A) D6.1(A) D6.3(A) L1.P$1 ; also sheet 4
M+ [mains]: D3.1(A) D3.3(A) D4.4(C) F3.2 ; also sheet 3
M+_IN [mains]: F3.1 J21.2
M- [mains]: D5.1(A) D5.3(A) D6.4(C) J21.1 ; also sheet 4
N$1 [5V]: C33.1 C34.1 D7.2(C) U10.1(INPUT)
N$4 [5V]: C36.1 C37.1 D8.2(C) U11.1(INPUT)
V-5_LOAD: C38.1 TP19.P$1 U11.3(OUTPUT) ; also sheet 3,4
V-12V_PROT [power]: Q6.D TP17.P$1 ; also sheet 3,4
V-HVDC [HVDC]: C30.+ C31.+ C32.+ D3.4(C) D5.4(C) ; also sheet 4

### Notes on the sheet
- drive voltage = 10V
  Id = -8.8A continuous
- Ferrite bead
  742792651
- 12V INPUT:
  
  204W - LRS-200-12 = $41.7
  240W - SP-240-12 = $91.7
- add heat sink to diodes
- AC Mains Switch: RA81231121
- 125V rated
  10A: SSQ 10
  12A: SSQ 12
- distribute around board
- full-wave diodes:
  SMD: DSEP40-03AS
  TR-H: MBR40250TG
- DC Fan for cooling

## Library data of the parts
C1-C6 C8-C15 C19-C21 C23-C25 = rcl:C-US: CAPACITOR, American symbol; SPICEPREFIX: C
C7 C33 C36 = SparkFun-Capacitors:1.0UF: 1µF ceramic capacitors A capacitor is a passive two-terminal electrical component used to store electrical energy temporarily in an electric field.; PROD_ID: CAP-00868
C16-C18 C22 C26 = SparkFun-Capacitors:47UF-POLAR: 47µF polarized capacitors A capacitor is a passive two-terminal electrical component used to store electrical energy temporarily in an electric field.; PROD_ID: CAP-08478
C27-C29 = SparkFun-Capacitors:0.1UF: 0.1µF ceramic capacitors A capacitor is a passive two-terminal electrical component used to store electrical energy temporarily in an electric field.; PROD_ID: CAP-00810
C30-C32 = smoothio:UCS2E470MHD1TO
C34 C37 = SmartPrj:C-EU: CAPACITOR, European symbol
C35 C38 = SparkFun-Capacitors:10UF: 10.0µF ceramic capacitors A capacitor is a passive two-terminal electrical component used to store electrical energy temporarily in an electric field.; PROD_ID: CAP-11330
D1 D2 = smoothio:SK520TR
D3-D6 = smoothio:DSEP40-03AS
D7 D8 = smoothio:MBR0530
F1 F2 = smoothio:SSQ7
F3 = smoothio:SSQ10
IC1 = SmartPrj:ATMEGA2560: MICROCONTROLLER 64/128/256 Kbytes FLASH 4 Kbytes EEPROM 8 Kbytes SRAM 86 General Purpose I/O pins 12-channels16-bit PWM 4 x Serial USARTs 16-channels 10-bit A/D
J1 J2 J9-J14 J16 = SparkFun-Connectors:CONN_02: Multi connection point. Often used as Generic Header-pin footprint for 0.1 inch spaced/style header connections On any of the 0.1 inch spaced packages, you can populate with these: Break Away Headers - Straight <https://www.sparkfun.com/products/116> (PRT-00116) Break Away Male Headers - Right Angle <https://www.sparkfun.com/products/553> (PRT-00553) Female Headers <https://www.sparkfun.com/products/115> (PRT-00115) Break Away Headers - Machine Pin <https://www.sparkfun.com/products/117> (PRT-00117) Break Away Female Headers - Swiss Machine Pin <https://www.sparkfun.com/products/743> (PRT-00743) For SCREWTERMINALS and SPRING TERMINALS visit here: Screw Terimnals on SparkFun.com <https://www.sparkfun.com/search/results?term=Screw+Terminals> (5mm/3.5mm/2.54mm spacing) This device is also useful as a general connection point to wire up your design to another part of your project. Our various solder wires solder well into these plated through hole pads. Hook-Up Wire - Assortment (Stranded, 22 AWG) <https://www.sparkfun.com/products/11375> (PRT-11375) Hook-Up Wire - Assortment (Solid Core, 22 AWG) <https://www.sparkfun.com/products/11367> (PRT-11367) View the entire wire category on our website here <https://www.sparkfun.com/categories/141> Special notes: Molex polarized connector foot print use with: PRT-08233 with associated crimp pins and housings. 2.54_SCREWTERM for use with PRT-10571. 3.5mm Screw Terminal footprints for PRT-08084 5mm Screw Terminal footprints for use with PRT-08432
J3 J4 = SparkFun-Connectors:RJ45-8: RJ45 Jack - 8 pin Simple RJ45, 8-pin connection. Commonly used for Cat5, Cat5e, and Cat6 Ethernet cables. Here is the connector we sell at SparkFun: RJ45 8-Pin Connector <https://www.sparkfun.com/products/643> (PRT-00643) Datasheet <https://cdn.sparkfun.com/datasheets/Prototyping/04908.pdf> It is used on this SparkFun product: SparkFun RJ45 Breakout <https://www.sparkfun.com/products/716> (BOB-00716) Note, you may also be interested in the "MAGJACK" version of this. It is basically a RJ45 connector, but also has some status LEDs built into the connector housing. You can check that out in this library at the device named "MAGJACK.dev" and see these products online: RJ45 Ethernet MagJack-Compatible <https://www.sparkfun.com/products/8534> (PRT-08534) SparkFun RJ45 MagJack Breakout <https://www.sparkfun.com/products/13021> (BOB-13021); PROD_ID: CONN-08506; SF_ID: PRT-00643
J5 J6 J20 J23 = smoothio:OSTVN08A150
J7 = smoothio:DRV8825CARRIER
J8 J17-J19 = smoothio:OSTVN06A150
J15 J21 J22 = 1935161:1935161: Conn Terminal Blocks 2 POS 5mm Solder ST Thru-Hole 16A; DESCRIPTION: Conn Terminal Blocks 2 POS 5mm Solder ST Thru-Hole 16A; MF: Phoenix Contact; MP: 1935161; PACKAGE: None
JP1 JP2 = SmartPrj:PINHD-1X8: PIN HEADER
JP3-JP10 = SparkFun-Jumpers:JUMPER-SMT_2_NO: Normally open jumper This jumper has two pads in close proximity to each other. Apply solder to close the connection. Round pads are easier to solder for beginners, but are a lot larger. SparkFun Product that uses the round pads: SparkFun EL Sequencer <https://www.sparkfun.com/products/12781>
JP11 = SmartPrj:PINHD-2X3: PIN HEADER
JP12-JP19 = SparkFun-Jumpers:JUMPER-SMT_2_NC_TRACE: Normally closed trace jumper This jumper has a trace between two pads so it's normally closed (NC). Use a razor knife to open the connection. For best results follow the IPC guidelines for cutting traces: Cutout at least 0.063 mm (0.005 in). Remove all loose material to clean up the cut area. Seal the cut with an approved epoxy. Reapply solder to reclose the connection.
JP20 = SparkFun-Jumpers:JUMPER-SMT_3_1-NC_TRACE: Normally closed trace jumper (1 of 2 connections) This jumper has a trace between two pads so it's normally closed (NC). The other connection is normally open (NO). Use a razor knife to open the connection. For best results follow the IPC guidelines for cutting traces: Cutout at least 0.063 mm (0.005 in). Remove all loose material to clean up the cut area. Seal the cut with an approved epoxy. Reapply solder to reclose the connection, or to close the NO connection.
K1 = ORWH-SH-112D1F:ORWH-SH-112D1F: ORWH Series Miniature PCB Relay with Wash Tight 1-Pole 1-Form C 1 CO 12 VDC 400 Ohm 360 mW Silver Zinc Oxide; DESCRIPTION: ORWH Series Miniature PCB Relay with Wash Tight 1-Pole 1-Form C 1 CO 12 VDC 400 Ohm 360 mW Silver Zinc Oxide; MF: TE Connectivity; MP: 1-1721150-3; PACKAGE: None; TE_PURCHASE_URL: https://www.te.com/usa-en/product-1-1721150-3.html?te_bu=Cor&te_type=disp&te_campaign=seda_glo_cor-seda-global-disp-prtnr-fy19-seda-model-bom-cta_sma-317_1&elqCampaignId=32493
L1 = smoothio:742792651
LED1-LED5 = led:LED: LED OSRAM: - CHIPLED LG R971, LG N971, LY N971, LG Q971, LY Q971, LO R971, LY R971 LH N974, LH R974 LS Q976, LO Q976, LY Q976 LO Q996 - Hyper CHIPLED LW Q18S LB Q993, LB Q99A, LB R99A - SideLED LS A670, LO A670, LY A670, LG A670, LP A670 LB A673, LV A673, LT A673, LW A673 LH A674 LY A675 LS A676, LA A676, LO A676, LY A676, LW A676 LS A679, LY A679, LG A679 - Hyper Micro SIDELED® LS Y876, LA Y876, LO Y876, LY Y876 LT Y87S - SmartLED LW L88C, LW L88S LB L89C, LB L89S, LG L890 LS L89K, LO L89K, LY L89K LS L896, LA L896, LO L896, LY L896 - TOPLED LS T670, LO T670, LY T670, LG T670, LP T670 LSG T670, LSP T670, LSY T670, LOP T670, LYG T670 LG T671, LOG T671, LSG T671 LB T673, LV T673, LT T673, LW T673 LH T674 LS T676, LA T676, LO T676, LY T676, LB T676, LH T676, LSB T676, LW T676 LB T67C, LV T67C, LT T67C, LS T67K, LO T67K, LY T67K, LW E67C LS E67B, LA E67B, LO E67B, LY E67B, LB E67C, LV E67C, LT E67C LW T67C LS T679, LY T679, LG T679 LS T770, LO T770, LY T770, LG T770, LP T770 LB T773, LV T773, LT T773, LW T773 LH T774 LS E675, LA E675, LY E675, LS T675 LS T776, LA T776, LO T776, LY T776, LB T776 LHGB T686 LT T68C, LB T68C - Hyper Mini TOPLED® LB M676 - Mini TOPLED Santana® LG M470 LS M47K, LO M47K, LY M47K Source: http://www.osram.convergy.de LUXEON: - LUMILED® LXK2-PW12-R00, LXK2-PW12-S00, LXK2-PW14-U00, LXK2-PW14-V00 LXK2-PM12-R00, LXK2-PM12-S00, LXK2-PM14-U00 LXK2-PE12-Q00, LXK2-PE12-R00, LXK2-PE12-S00, LXK2-PE14-T00, LXK2-PE14-U00 LXK2-PB12-K00, LXK2-PB12-L00, LXK2-PB12-M00, LXK2-PB14-N00, LXK2-PB14-P00, LXK2-PB14-Q00 LXK2-PR12-L00, LXK2-PR12-M00, LXK2-PR14-Q00, LXK2-PR14-R00 LXK2-PD12-Q00, LXK2-PD12-R00, LXK2-PD12-S00 LXK2-PH12-R00, LXK2-PH12-S00 LXK2-PL12-P00, LXK2-PL12-Q00, LXK2-PL12-R00 Source: www.luxeon.com KINGBRIGHT: KA-3528ASYC Source: www.kingbright.com
Q1 Q2 = BSS138L:BSS138L: BSS138L N-Channel Logic Level Enhancement Mode Field Effect Transistor; AVAILABILITY: Unavailable; DESCRIPTION: Small Signal MOSFET 50V 200mA 3.5 Ohm Single N-Channel SOT-23 Logic Level; MF: ON Semiconductor; MP: BSS138L; PACKAGE: SOT-23 ON Semiconductor; PRICE: None
Q3-Q5 = smoothio:PHB45NQ15T
Q6 = smoothio:IRFR9024TRPBF
R1 R18 R19 R24-R27 = SparkFun-Resistors:10KOHM: 10kΩ resistor A resistor is a passive two-terminal electrical component that implements electrical resistance as a circuit element. Resistors act to reduce current flow, and, at the same time, act to lower voltage levels within circuits. - Wikipedia; PROD_ID: RES-00824
R2 = SparkFun-Resistors:0OHM: 0Ω resistor A resistor is a passive two-terminal electrical component that implements electrical resistance as a circuit element. Resistors act to reduce current flow, and, at the same time, act to lower voltage levels within circuits. - Wikipedia; PROD_ID: RES-08609
R3-R7 = SparkFun-Resistors:1KOHM: 1kΩ resistor A resistor is a passive two-terminal electrical component that implements electrical resistance as a circuit element. Resistors act to reduce current flow, and, at the same time, act to lower voltage levels within circuits. - Wikipedia; PROD_ID: RES-07856
R8 R10 R11 R13 = SparkFun-Resistors:390OHM: 390Ω resistor A resistor is a passive two-terminal electrical component that implements electrical resistance as a circuit element. Resistors act to reduce current flow, and, at the same time, act to lower voltage levels within circuits. - Wikipedia; PROD_ID: RES-07864
R9 R12 = SparkFun-Resistors:100OHM: 100Ω resistor A resistor is a passive two-terminal electrical component that implements electrical resistance as a circuit element. Resistors act to reduce current flow, and, at the same time, act to lower voltage levels within circuits. - Wikipedia; PROD_ID: RES-07863
R14 R15 = SparkFun-Resistors:4.7KOHM: 4.7kΩ resistor A resistor is a passive two-terminal electrical component that implements electrical resistance as a circuit element. Resistors act to reduce current flow, and, at the same time, act to lower voltage levels within circuits. - Wikipedia; PROD_ID: RES-07857
R16 R17 = SparkFun-Resistors:220OHM: 220Ω resistor A resistor is a passive two-terminal electrical component that implements electrical resistance as a circuit element. Resistors act to reduce current flow, and, at the same time, act to lower voltage levels within circuits. - Wikipedia; PROD_ID: RES-07861
R20 R21 = SparkFun-Resistors:1MOHM: 1MΩ resistor A resistor is a passive two-terminal electrical component that implements electrical resistance as a circuit element. Resistors act to reduce current flow, and, at the same time, act to lower voltage levels within circuits. - Wikipedia; PROD_ID: RES-07868
R22 R23 = smoothio:CSR1206FT50L0
R28 R29 = SparkFun-Resistors:RESISTOR: Generic Resistor Package
S1 = FSM2JSMA:FSM2JSMA: FSM2JSMA=SMT,TACTILE,PB SWITCH; AVAILABILITY: Unavailable; COMMENT: 2-1437565-7; DESCRIPTION: FSM2JSMA=SMT,TACTILE,PB SWITCH; MF: TE Connectivity; MP: FSM2JSMA; PACKAGE: None; PRICE: None; TE_PURCHASE_URL: https://www.te.com/usa-en/product-2-1437565-7.html?te_bu=Cor&te_type=disp&te_campaign=seda_glo_cor-seda-global-disp-prtnr-fy19-seda-model-bom-cta_sma-317_1&elqCampaignId=32493
TP1-TP20 = SparkFun-Connectors:TEST-POINT: SparkFun Test Points Bare copper test points for troubleshooting or In-Circuit-Testing. These are used by our Production team for verifying production board runs using pogo-pins on test beds. SparkFun Products: SparkFun LSM9DS1 Breakout <https://www.sparkfun.com/products/13284> SparkFun PSOC <https://www.sparkfun.com/products/13714> SparkFun Load Cell Amplifier <https://www.sparkfun.com/products/13879>
U1 = SparkFun_Differential_I2C_Breakout_PCA9615_Qwiic:PCA9615: Differential I2C Bus Buffer Datasheet <https://www.nxp.com/docs/en/data-sheet/PCA9615.pdf>
U2 U3 = VNQ5E160KTR-E:VNQ5E160KTR-E: None; AVAILABILITY: Unavailable; DESCRIPTION: VNQ5E160K-E Series 28 V 160 mOhm Quad Channel High Side Driver - PowerSSO-24; MF: STMicroelectronics; MP: VNQ5E160KTR-E; PACKAGE: SOP-24 STMicroelectronics; PRICE: None
U4 U5 = smoothio:EL3H7
U6 U8 = INA213AIDCKT:INA213AIDCKT: CURRENT SHUNT MONITOR; AVAILABILITY: Unavailable; DESCRIPTION: 26-V, Bi-Directional, Zero-Drift, High Accuracy, Low-/High-Side, Voltage Out Current Shunt Monitor 6-SC70 -40 to 125; MF: Texas Instruments; MP: INA213AIDCKT; PACKAGE: SC-70 Texas Instruments; PRICE: None
U7 U9 = VNH7070ASTR:VNH7070ASTR: None; AVAILABILITY: Unavailable; DESCRIPTION: VNH7070AS Series 15 A Automotive fully integrated H-bridge motor driver-SO-16N; MF: STMicroelectronics; MP: VNH7070ASTR; PACKAGE: SO-16 STMicroelectronics; PRICE: None
U10 U11 = LM340MP-5.0_NOPB:LM340MP-5.0/NOPB: Series 3-Terminal Positive Regulators 4-SOT-223 0 to 70; DESCRIPTION: National Semiconductor Lm340mp-5.0 / Ic 5v 1a Voltage Reg Sot-223; DIGI-KEY_PART_NUMBER: 296-35905-1-ND; DIGI-KEY_PURCHASE_URL: https://www.digikey.com/product-detail/en/texas-instruments/LM340MP-5.0/296-35905-1-ND/3700181?utm_source=snapeda&utm_medium=aggregator&utm_campaign=symbol; MF: Texas Instruments; MP: LM340MP-5.0; PACKAGE: SOT-223 Texas Instruments
Y1 = ABLS-16.000MHZ-B4-T:ABLS-16.000MHZ-B4-T: 16MHz ±30ppm Crystal 18pF 40 Ohms HC-49/US; AVAILABILITY: Unavailable; DESCRIPTION: Crystal, Hc49/u Smd, 8.000mhz, 18pf, 20ppm; MF: Abracon; MP: ABLS-8.000MHZ-B2; PACKAGE: None; PRICE: None

## Net classes
0 default: width 0.203 mm, drill 0.406 mm, clearance 0.203 mm
1 power: width 0.508 mm, drill 0.406 mm, clearance 0.254 mm
2 gnd: width 0.203 mm, drill 0.406 mm, clearance 0.203 mm
3 mains: width 1.905 mm, drill 0.406 mm, clearance 2.286 mm
4 HVDC: width 1.27 mm, drill 0.406 mm, clearance 2.032 mm